# Altium project SynthyTwo.Project.PrjPcb
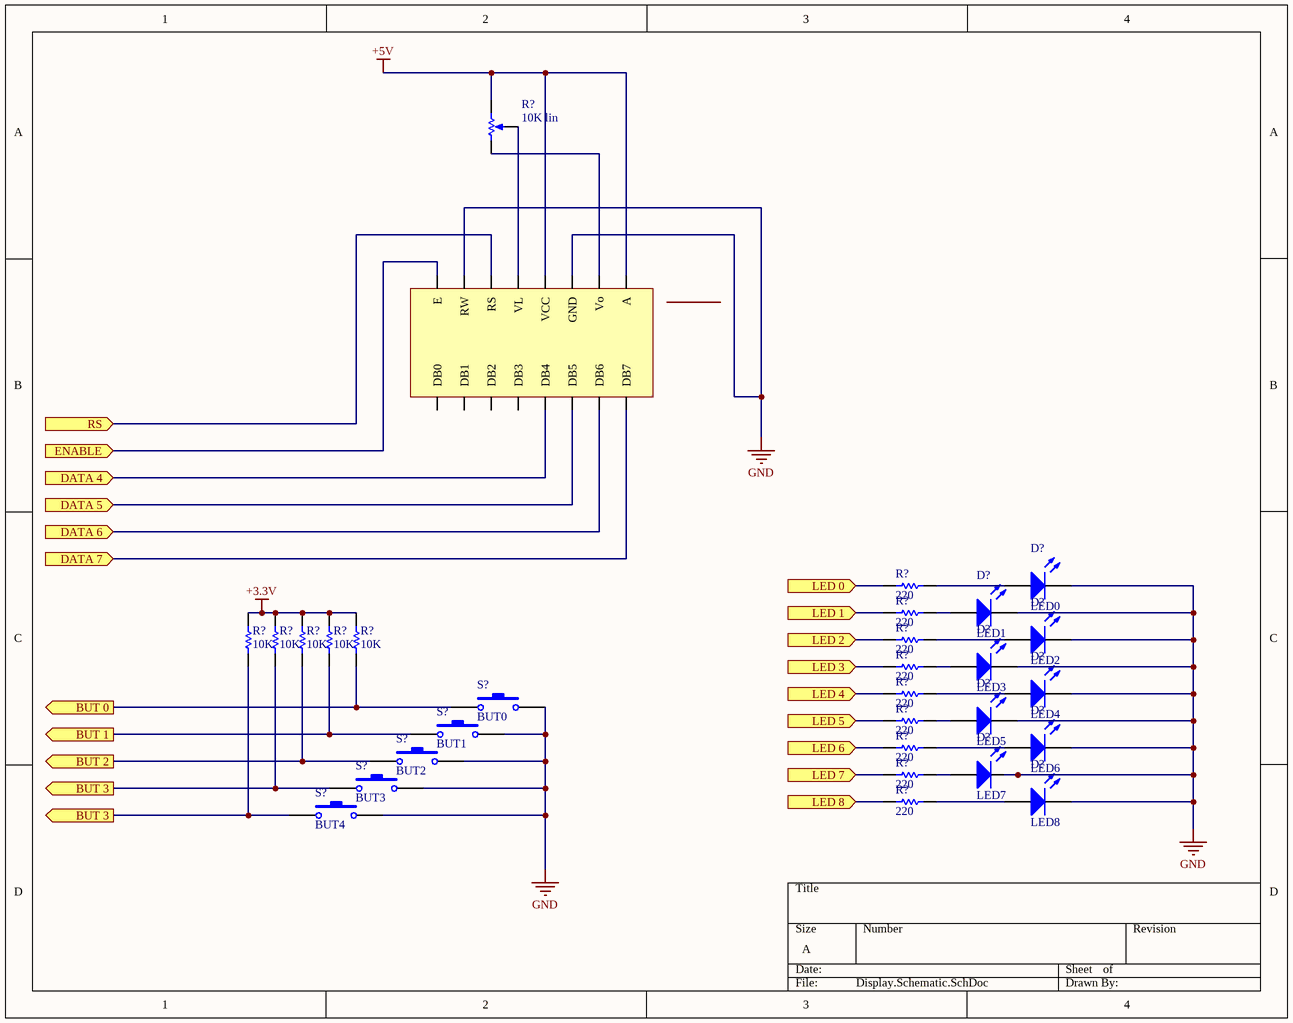
[diagram p0: Display.Schematic.SchDoc]
5 sheets, 172 parts. Net scope: flat (ports and power ports of the same name join across sheets).
Sheets:
  Display.Schematic.SchDoc
  FilterBoard.Schematic.SchDoc
  Output.Schematic.SchDoc
  MIDI.Schematic.SchDoc
  Encodeurs.Schematic.SchDoc

## Sheet Display.Schematic.SchDoc
size A

### Parts
(Parts that share a designator on the sheet are numbered #1, #2 ... from top to bottom, then left to right.)
*  16x2 LCD  (value not drawn)
D?#1  LED0  [LED-0]
D?#2  LED1  [LED-0]
D?#3  LED2  [LED-0]
D?#4  LED3  [LED-0]
D?#5  LED4  [LED-0]
D?#6  LED5  [LED-0]
D?#7  LED6  [LED-0]
D?#8  LED7  [LED-0]
D?#9  LED8  [LED-0]
R?#1  10K lin  [VR5]
R?#2  220  [AXIAL-0.3]
R?#3  220  [AXIAL-0.3]
R?#4  220  [AXIAL-0.3]
R?#5  10K  [AXIAL-0.3]
R?#6  10K  [AXIAL-0.3]
R?#7  10K  [AXIAL-0.3]
R?#8  10K  [AXIAL-0.3]
R?#9  10K  [AXIAL-0.3]
R?#10  220  [AXIAL-0.3]
R?#11  220  [AXIAL-0.3]
R?#12  220  [AXIAL-0.3]
R?#13  220  [AXIAL-0.3]
R?#14  220  [AXIAL-0.3]
R?#15  220  [AXIAL-0.3]
S?#1  BUT0  [SPST-2]
S?#2  BUT1  [SPST-2]
S?#3  BUT2  [SPST-2]
S?#4  BUT3  [SPST-2]
S?#5  BUT4  [SPST-2]

### Ports
BUT 0 (out), BUT 1 (out), BUT 2 (out), BUT 3 (out), DATA 4 (in), DATA 5 (in), DATA 6 (in), DATA 7 (in), ENABLE (in), LED 0 (in), LED 1 (in), LED 2 (in), LED 3 (in), LED 4 (in), LED 5 (in), LED 6 (in), LED 7 (in), LED 8 (in), RS (in)

### Nets
+3.3V: R?#5.2 R?#6.2 R?#7.2 R?#8.2 R?#9.2
+5V: *.2(VCC) *.16(A) R?#1.2(BOT)
GND: *.1(GND) *.5(RW) D?#1.2(K) D?#2.2(K) D?#3.2(K) D?#4.2(K) D?#5.2(K) D?#6.2(K) D?#7.2(K) D?#8.2(K) D?#9.2(K) S?#1.2 S?#2.2 S?#3.2 S?#4.2 S?#5.2
Net*_3: *.3(VL) R?#1.3(TAP)
Net*_4: *.4(RS) ; port RS
Net*_6: *.6(E) ; port ENABLE
Net*_7: *.7(DB7) ; port DATA 7
Net*_8: *.8(DB6) ; port DATA 6
Net*_9: *.9(DB5) ; port DATA 5
Net*_10: *.10(DB4) ; port DATA 4
Net*_15: *.15(Vo) R?#1.1(TOP)
NetD?#1_1: D?#1.1(A) R?#2.2
NetD?#2_1: D?#2.1(A) R?#3.2
NetD?#3_1: D?#3.1(A) R?#4.2
NetD?#4_1: D?#4.1(A) R?#10.2
NetD?#5_1: D?#5.1(A) R?#11.2
NetD?#6_1: D?#6.1(A) R?#12.2
NetD?#7_1: D?#7.1(A) R?#13.2
NetD?#8_1: D?#8.1(A) R?#14.2
NetD?#9_1: D?#9.1(A) R?#15.2
NetR?#2_1: R?#2.1 ; port LED 0
NetR?#3_1: R?#3.1 ; port LED 1
NetR?#4_1: R?#4.1 ; port LED 2
NetR?#5_1: R?#5.1 R?#6.1 S?#4.1 S?#5.1 ; port BUT 3
NetR?#7_1: R?#7.1 S?#3.1 ; port BUT 2
NetR?#8_1: R?#8.1 S?#2.1 ; port BUT 1
NetR?#9_1: R?#9.1 S?#1.1 ; port BUT 0
NetR?#10_1: R?#10.1 ; port LED 3
NetR?#11_1: R?#11.1 ; port LED 4
NetR?#12_1: R?#12.1 ; port LED 5
NetR?#13_1: R?#13.1 ; port LED 6
NetR?#14_1: R?#14.1 ; port LED 7
NetR?#15_1: R?#15.1 ; port LED 8

Not connected (* = marked no-connect by the designer): * 11(DB3) 12(DB2) 13(DB1) 14(DB0)

### Library data of the parts
* = Display
D?#1-D?#9 = LED0: Typical INFRARED GaAs LED; Published: 8-Jun-2000; LatestRevisionDate: 08-Jul-2005; LatestRevisionNote: Mech Layer 1 removed.; PackageReference: LED-0; Publisher: Altium Limited; PackageDescription: LED; 2 Leads
R?#1 = RPot: Potentiometer; Sim Note: Enter the Resistance value and the set point into parameter fields.; Set Position: 0.5; Published: 8-Jun-2000; LatestRevisionDate: 17-Jul-2002; LatestRevisionNote: Re-released for DXP Platform.; PackageReference: VR5; Publisher: Altium Limited; PackageDescription: Variable Resistor, Thru-Hole; 3 Leads; Value: 10K
R?#2 R?#3 R?#5-R?#9 = Res1: Resistor; Value: 1K; Published: 8-Jun-2000; LatestRevisionDate: 17-Jul-2002; LatestRevisionNote: Re-released for DXP Platform.; PackageReference: AXIAL-0.3; Publisher: Altium Limited; PackageDescription: Axial Device, Thru-Hole; 2 Leads; 0.3 in Pin Spacing
R?#4 R?#10-R?#15 = Res1: Resistor; Published: 8-Jun-2000; LatestRevisionDate: 17-Jul-2002; LatestRevisionNote: Re-released for DXP Platform.; PackageReference: AXIAL-0.3; Publisher: Altium Limited; PackageDescription: Axial Device, Thru-Hole; 2 Leads; 0.3 in Pin Spacing; Value: 220
S?#1-S?#5 = SW-PB: Switch; Published: 24-Mar-1999; LatestRevisionDate: 17-Jul-2002; LatestRevisionNote: Re-released for DXP Platform.; PackageReference: SPST-2; Publisher: Altium Limited; PackageDescription: Switch; 2 Leads

## Sheet FilterBoard.Schematic.SchDoc
size B
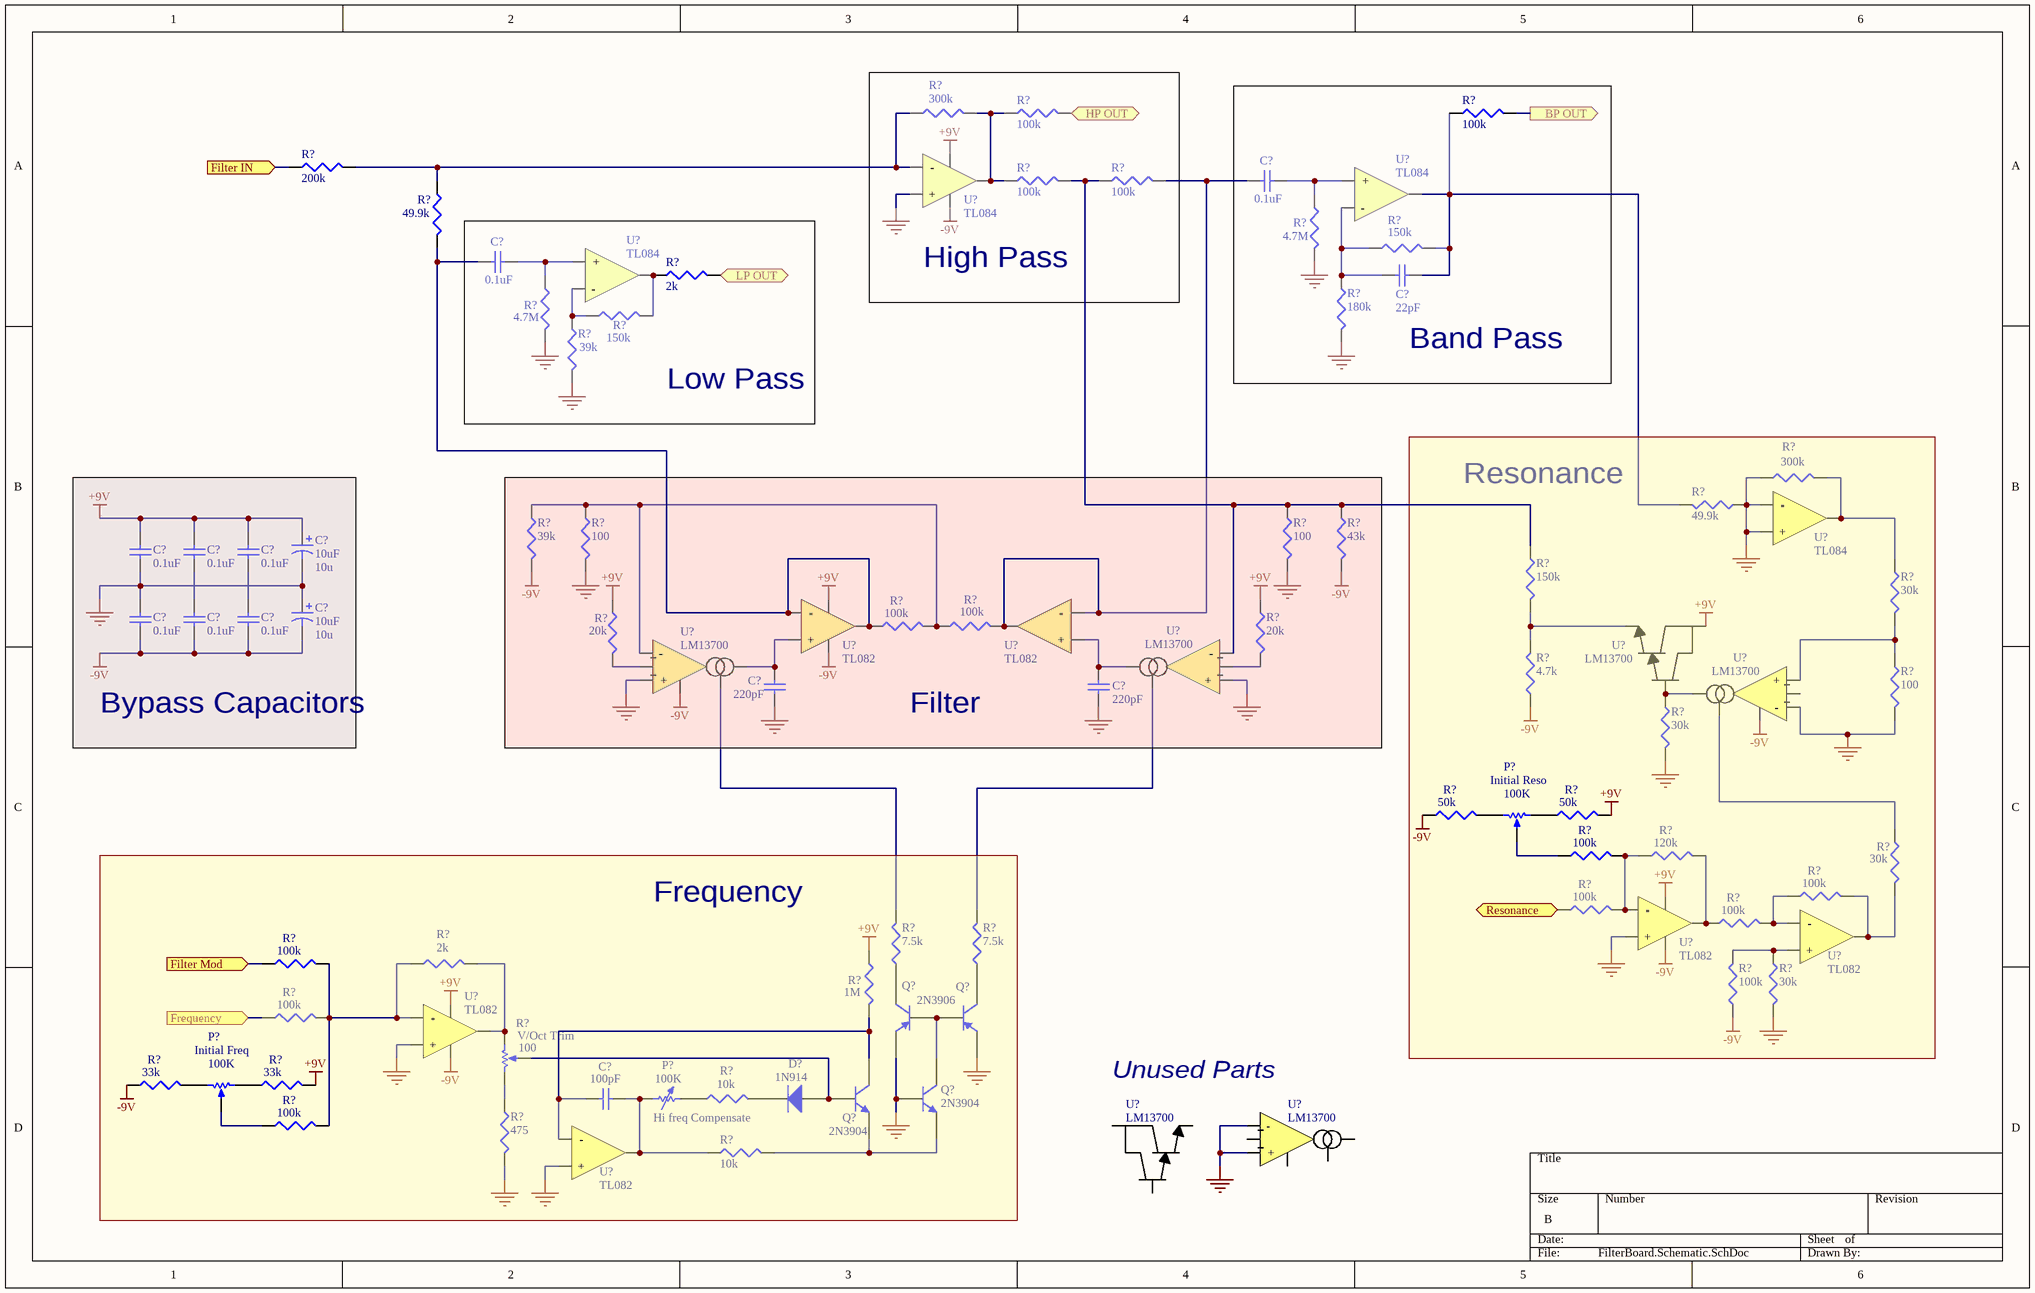
[diagram p1: FilterBoard.Schematic.SchDoc]

### Parts
(Parts that share a designator on the sheet are numbered #1, #2 ... from top to bottom, then left to right.)
C?#1  0.1uF  [C1206]
C?#2  0.1uF  [C1206]
C?#3  22pF  [C1206]
C?#4  10uF  value 10u  [RB7.6-15]
C?#5  0.1uF  [C1206]
C?#6  0.1uF  [C1206]
C?#7  0.1uF  [C1206]
C?#8  10uF  value 10u  [RB7.6-15]
C?#9  0.1uF  [C1206]
C?#10  0.1uF  [C1206]
C?#11  0.1uF  [C1206]
C?#12  220pF  [C1206]
C?#13  220pF  [C1206]
C?#14  100pF  [C1206]
D?#10  1N914  [DO-41]
P?#1  Initial Reso  value 100K  [VR5]
P?#2  Hi freq Compensate  value 100K  [AXIAL-0.7]
P?#3  Initial Freq  value 100K  [VR5]
Q?#1  2N3906  [TO-92A]
Q?#2  2N3906  [TO-92A]  (value not drawn)
Q?#3  2N3904  [TO-92A]
Q?#4  2N3904  [TO-92A]
R?#16  300k  [J1-0603]
R?#17  100k  [J1-0603]
R?#18  100k  [J1-0603]
R?#19  200k  [J1-0603]
R?#20  100k  [J1-0603]
R?#21  100k  [J1-0603]
R?#22  49.9k  [J1-0603]
R?#23  4.7M  [J1-0603]
R?#24  150k  [J1-0603]
R?#25  2k  [J1-0603]
R?#26  4.7M  [J1-0603]
R?#27  180k  [J1-0603]
R?#28  150k  [J1-0603]
R?#29  39k  [J1-0603]
R?#30  300k  [J1-0603]
R?#31  39k  [J1-0603]
R?#32  100  [J1-0603]
R?#33  100  [J1-0603]
R?#34  43k  [J1-0603]
R?#35  49.9k  [J1-0603]
R?#36  150k  [J1-0603]
R?#37  30k  [J1-0603]
R?#38  20k  [J1-0603]
R?#39  100k  [J1-0603]
R?#40  100k  [J1-0603]
R?#41  20k  [J1-0603]
R?#42  100  [J1-0603]
R?#43  4.7k  [J1-0603]
R?#44  30k  [J1-0603]
R?#45  50k  [J1-0603]
R?#46  50k  [J1-0603]
R?#47  100k  [J1-0603]
R?#48  120k  [J1-0603]
R?#49  30k  [J1-0603]
R?#50  100k  [J1-0603]
R?#51  100k  [J1-0603]
R?#52  100k  [J1-0603]
R?#53  100k  [J1-0603]
R?#54  2k  [J1-0603]
R?#55  7.5k  [J1-0603]
R?#56  1M  [J1-0603]
R?#57  7.5k  [J1-0603]
R?#58  30k  [J1-0603]
R?#59  100k  [J1-0603]
R?#60  100k  [J1-0603]
R?#61  V/Oct Trim  value 100  [VR5]
R?#62  33k  [J1-0603]
R?#63  33k  [J1-0603]
R?#64  10k  [J1-0603]
R?#65  100k  [J1-0603]
R?#66  475  [J1-0603]
R?#67  10k  [J1-0603]
U?#1  TL084
U?#2  TL084
U?#3  TL084
U?#4  TL084
U?#5  TL082
U?#6  TL082
U?#7  LM13700
U?#8  LM13700
U?#9  LM13700
U?#10  LM13700
U?#11  TL082
U?#12  TL082
U?#13  TL082
U?#14  LM13700
U?#15  TL082
U?#16  LM13700

### Blocks framed on the sheet
High Pass: R?#16 R?#17 R?#20 R?#21 U?#1
Band Pass: C?#1 C?#3 R?#18 R?#23 R?#24 R?#27 U?#2
Low Pass: C?#2 R?#25 R?#26 R?#28 R?#29 U?#3
Resonance: P?#1 R?#30 R?#35-R?#37 R?#42-R?#52 R?#58 R?#60 U?#4 U?#9-U?#12
Bypass Capacitors: C?#4-C?#11
Filter: C?#12 C?#13 R?#31-R?#34 R?#38-R?#41 U?#5-U?#8
Frequency: C?#14 D?#10 P?#2 P?#3 Q?#1-Q?#4 R?#53-R?#57 R?#59 R?#61-R?#67 U?#13 U?#15

### Ports
BP OUT (out), Filter IN (in), Filter Mod (in), Frequency (in), HP OUT (out), LP OUT (out), Resonance (in)

### Nets
+9V: C?#4.1 C?#5.2 C?#6.2 C?#7.2 R?#38.1 R?#41.1 R?#46.2 R?#56.1 R?#63.2 U?#1.4(VCC+) U?#5.8(VCC+) U?#9.11(V+) U?#11.8(VCC+) U?#13.8(VCC+)
-9V: C?#8.2 C?#9.1 C?#10.1 C?#11.1 R?#31.2 R?#34.2 R?#43.1 R?#45.1 R?#60.1 R?#62.1 U?#1.11(VCC-) U?#5.4(VCC-) U?#7.6(VCC-) U?#10.6(VCC-) U?#11.4(VCC-) U?#13.4(VCC-)
GND: C?#4.2 C?#5.1 C?#8.1 C?#9.2 C?#12.1 C?#13.1 Q?#1.1(E) Q?#2.1(E) Q?#4.2(B) R?#23.2 R?#26.2 R?#27.2 R?#29.2 R?#30.1 R?#32.2 R?#33.2 R?#35.1 R?#42.2 R?#44.2 R?#58.2 R?#66.2 U?#1.3(+) U?#4.12(-) U?#4.13(+) U?#7.3(+) U?#8.3(+) U?#10.3(-) U?#11.3(+) U?#13.3(+) U?#14.3(+) U?#14.4(-) U?#15.5(+)
NetC?#1_1: C?#1.1 R?#21.2 R?#40.2 U?#6.6(-) U?#6.7(OUT)
NetC?#1_2: C?#1.2 R?#23.1 U?#2.5(+)
NetC?#2_1: C?#2.1 R?#22.2 R?#39.1 U?#5.1(OUT) U?#5.2(-)
NetC?#2_2: C?#2.2 R?#26.1 U?#3.5(+)
NetC?#3_1: C?#3.1 R?#24.1 R?#27.1 U?#2.3(-)
NetC?#3_2: C?#3.2 R?#18.1 R?#24.2 R?#35.2 U?#2.7(OUT)
NetC?#6_1: C?#6.1 C?#10.2
NetC?#7_1: C?#7.1 C?#11.2
NetC?#12_2: C?#12.2 U?#5.3(+) U?#7.5(OUT)
NetC?#13_2: C?#13.2 U?#6.5(+) U?#8.5(OUT)
NetC?#14_1: C?#14.1 Q?#3.3(C) R?#56.2 U?#15.6(-)
NetC?#14_2: C?#14.2 P?#2.1 R?#67.1 U?#15.7(OUT)
NetD?#10_1: D?#10.1(A) Q?#3.2(B) R?#61.3(TAP)
NetD?#10_2: D?#10.2(K) R?#64.2
NetP?#1_1: P?#1.1(TOP) R?#46.1
NetP?#1_2: P?#1.2(BOT) R?#45.2
NetP?#1_3: P?#1.3(TAP) R?#47.1
NetP?#2_2: P?#2.2 R?#64.1
NetP?#3_1: P?#3.1(TOP) R?#63.1
NetP?#3_2: P?#3.2(BOT) R?#62.2
NetP?#3_3: P?#3.3(TAP) R?#65.1
NetQ?#1_2: Q?#1.2(B) Q?#2.2(B) Q?#4.3(C)
NetQ?#1_3: Q?#1.3(C) R?#55.1
NetQ?#2_3: Q?#2.3(C) R?#57.1
NetQ?#3_1: Q?#3.1(E) Q?#4.1(E) R?#67.2
NetR?#16_1: R?#16.1 R?#19.2 R?#22.1 U?#1.2(-)
NetR?#16_2: R?#16.2 R?#17.1 R?#20.1 U?#1.1(OUT)
NetR?#17_2: R?#17.2 ; port HP OUT
NetR?#18_2: R?#18.2 ; port BP OUT
NetR?#19_1: R?#19.1 ; port Filter IN
NetR?#20_2: R?#20.2 R?#21.1 R?#33.1 R?#34.1 R?#36.1 U?#8.4(-)
NetR?#25_1: R?#25.1 R?#28.2 U?#3.7(OUT)
NetR?#25_2: R?#25.2 ; port LP OUT
NetR?#28_1: R?#28.1 R?#29.1 U?#3.3(-)
NetR?#30_2: R?#30.2 R?#37.1 U?#4.14(OUT)
NetR?#31_1: R?#31.1 R?#32.1 R?#39.2 R?#40.1 U?#7.4(-)
NetR?#36_2: R?#36.2 R?#43.2 U?#9.8(BOUT)
NetR?#37_2: R?#37.2 R?#42.1 U?#10.4(+)
NetR?#38_2: R?#38.2 U?#7.2
NetR?#41_2: R?#41.2 U?#8.2
NetR?#44_1: R?#44.1 U?#9.7(BIN) U?#10.5(OUT)
NetR?#47_2: R?#47.2 R?#48.1 R?#51.2 U?#11.2(-)
NetR?#48_2: R?#48.2 R?#52.1 U?#11.1(OUT)
NetR?#49_1: R?#49.1 U?#10.1(BIAS)
NetR?#49_2: R?#49.2 R?#50.2 U?#12.7(OUT)
NetR?#50_1: R?#50.1 R?#52.2 U?#12.6(-)
NetR?#51_1: R?#51.1 ; port Resonance
NetR?#53_1: R?#53.1 ; port Filter Mod
NetR?#53_2: R?#53.2 R?#54.1 R?#59.2 R?#65.2 U?#13.2(-)
NetR?#54_2: R?#54.2 R?#61.1(TOP) U?#13.1(OUT)
NetR?#55_2: R?#55.2 U?#7.1(BIAS)
NetR?#57_2: R?#57.2 U?#8.1(BIAS)
NetR?#58_1: R?#58.1 R?#60.2 U?#12.5(+)
NetR?#59_1: R?#59.1 ; port Frequency
NetR?#61_2: R?#61.2(BOT) R?#66.1

Not connected (* = marked no-connect by the designer): U?#2 6(VCC+) 11(VCC-); U?#3 6(VCC+) 11(VCC-); U?#4 1(VCC+) 11(VCC-); U?#6 4(VCC-) 8(VCC+); U?#8 6(VCC-); U?#10 2; U?#12 4(VCC-) 8(VCC+); U?#14 1(BIAS) 2 5(OUT) 6(VCC-); U?#15 4(VCC-) 8(VCC+); U?#16 7(BIN) 8(BOUT) 11(V+)

### Notes on the sheet
- (near U?#16) Unused Parts

### Library data of the parts
C?#1 C?#2 C?#5-C?#7 C?#9-C?#11 = Cap Semi: Capacitor (Semiconductor SIM Model); Value: 0.1u; Published: 8-Jun-2000; LatestRevisionDate: 29-May-2009; LatestRevisionNote: IPC-7351 Footprint Added.; PackageReference: C1206; Publisher: Altium Limited; PackageDescription: Chip Capacitor
C?#3 = Cap Semi: Capacitor (Semiconductor SIM Model); Value: 22p; Published: 8-Jun-2000; LatestRevisionDate: 29-May-2009; LatestRevisionNote: IPC-7351 Footprint Added.; PackageReference: C1206; Publisher: Altium Limited; PackageDescription: Chip Capacitor
C?#4 C?#8 = Cap Pol1: Polarized Capacitor (Radial); Published: 8-Jun-2000; LatestRevisionDate: 17-Jul-2002; LatestRevisionNote: Re-released for DXP Platform.; PackageReference: RB7.6-15; Publisher: Altium Limited; PackageDescription: Polarized Capacitor (Radial); 2 Leads
C?#12 C?#13 = Cap Semi: Capacitor (Semiconductor SIM Model); Value: 220p; Published: 8-Jun-2000; LatestRevisionDate: 29-May-2009; LatestRevisionNote: IPC-7351 Footprint Added.; PackageReference: C1206; Publisher: Altium Limited; PackageDescription: Chip Capacitor
C?#14 = Cap Semi: Capacitor (Semiconductor SIM Model); Value: 100p; Published: 8-Jun-2000; LatestRevisionDate: 29-May-2009; LatestRevisionNote: IPC-7351 Footprint Added.; PackageReference: C1206; Publisher: Altium Limited; PackageDescription: Chip Capacitor
D?#10 = Diode 1N4001: 1 Amp General Purpose Rectifier; Published: 8-Jun-2000; LatestRevisionDate: 17-Jul-2002; LatestRevisionNote: Re-released for DXP Platform.; DatasheetVersion: 1998; PackageVersion: Aug-1999; PackageReference: DO-41; Publisher: Altium Limited; PackageDescription: Diode, Axial; Body 5.2 x 2.7 mm (LxDia. max), Lead Dia. 0.86 mm (max); Code_JEDEC: DO-204-AL; ComponentLink1Description: Manufacturer Link; ComponentLink1URL: http://www.fairchildsemi.com/; ComponentLink2Description: Datasheet; ComponentLink2URL: http://www.fairchildsemi.com/ds/1N%2F1N4001.pdf
P?#1 P?#3 R?#61 = RPot: as R?#1 on sheet Display.Schematic; Published: 8-Jun-2000; LatestRevisionDate: 17-Jul-2002; LatestRevisionNote: Re-released for DXP Platform.; PackageReference: VR5; Publisher: Altium Limited; PackageDescription: Variable Resistor, Thru-Hole; 3 Leads
P?#2 = Res Adj1: Variable Resistor; Set Position: 0.5; Published: 8-Jun-2000; LatestRevisionDate: 17-Jul-2002; LatestRevisionNote: Re-released for DXP Platform.; PackageReference: AXIAL-0.7; Publisher: Altium Limited; PackageDescription: Axial Device, Thru-Hole; 2 Leads; 0.7 in Pin Spacing
Q?#1 Q?#2 = 2N3906: PNP General Purpose Amplifier; Published: 8-Jun-2000; LatestRevisionDate: 15-Jan-2003; LatestRevisionNote: PCB Footprint 'BCY-W3/D4.7' replaced; DatasheetVersion: 1997; PackageVersion: Sep-1998; PackageReference: TO-92A; Publisher: Altium Limited; PackageDescription: TO, Flat Index; 3 In-Line, Axial Leads; Body Dia. 4.5mm; Leads 0.51 x 0.48 mm (max); ComponentLink1Description: Manufacturer Link; ComponentLink1URL: http://www.fairchildsemi.com/; ComponentLink2Description: Datasheet; ComponentLink2URL: http://www.fairchildsemi.com/ds/2N%2F2N3906.pdf
Q?#3 Q?#4 = 2N3904: NPN General Purpose Amplifier; Published: 8-Jun-2000; LatestRevisionDate: 15-Jan-2003; LatestRevisionNote: PCB Footprint 'BCY-W3/D4.7' replaced; DatasheetVersion: 1997; PackageVersion: Sep-1998; PackageReference: TO-92A; Publisher: Altium Limited; PackageDescription: TO, Flat Index; 3 In-Line, Axial Leads; Body Dia. 4.5mm; Leads 0.51 x 0.48 mm (max); ComponentLink1Description: Manufacturer Link; ComponentLink1URL: http://www.fairchildsemi.com/; ComponentLink2Description: Datasheet; ComponentLink2URL: http://www.fairchildsemi.com/ds/2N%2F2N3904.pdf
R?#16-R?#24 R?#26-R?#60 R?#62-R?#67 = Res3: Resistor; Published: 8-Jun-2000; LatestRevisionDate: 29-May-2009; LatestRevisionNote: IPC-7351 Footprint Added.; PackageReference: J1-0603; Publisher: Altium Limited; PackageDescription: Chip Resistor
  R?#16 R?#30: Value: 300K
  R?#17 R?#18 R?#20 R?#21 R?#39 R?#40 R?#47 R?#50-R?#53 R?#59 R?#60 R?#65: Value: 100K
  R?#19: Value: 200K
  R?#22 R?#35: Value: 49.9K
  R?#23 R?#26: Value: 4.7M
  R?#24 R?#28 R?#36: Value: 150K
  R?#27: Value: 180K
  R?#29 R?#31: Value: 39K
  R?#32 R?#33 R?#42: Value: 100
  R?#34: Value: 43K
  R?#37 R?#44 R?#49 R?#58: Value: 30K
  R?#38 R?#41: Value: 20K
  R?#43: Value: 4.7K
  R?#45 R?#46: Value: 50K
  R?#48: Value: 120K
  R?#54: Value: 2K
  R?#55 R?#57: Value: 7.5K
  R?#56: Value: 1M
  R?#62 R?#63: Value: 33K
  R?#64 R?#67: Value: 10K
  R?#66: Value: 475
R?#25 = Res3: Resistor; Value: 100K; Published: 8-Jun-2000; LatestRevisionDate: 29-May-2009; LatestRevisionNote: IPC-7351 Footprint Added.; PackageReference: J1-0603; Publisher: Altium Limited; PackageDescription: Chip Resistor
U?#9 U?#16 = LM13700_1

## Sheet Output.Schematic.SchDoc
size A
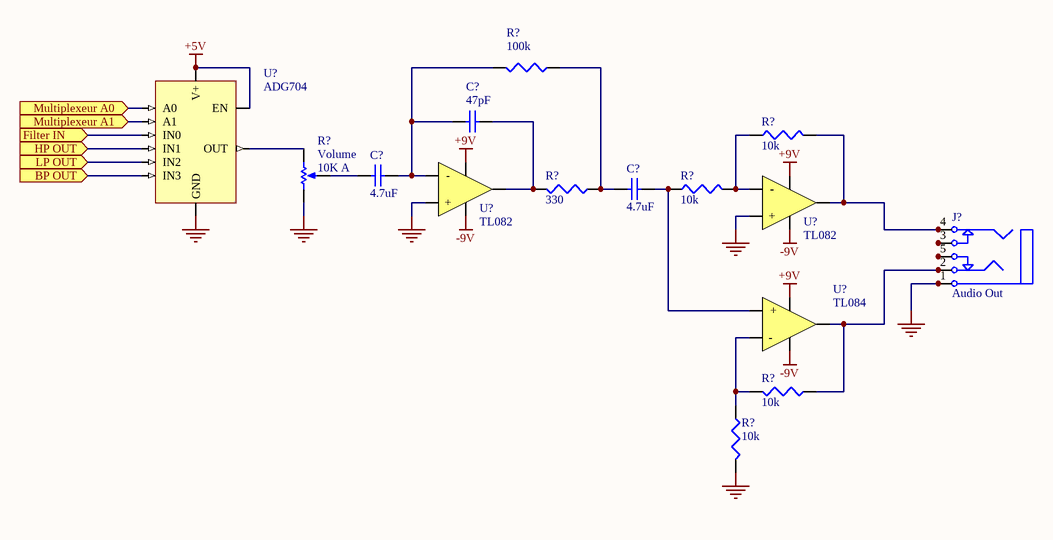
[diagram p2: Output.Schematic.SchDoc]

### Parts
(Parts that share a designator on the sheet are numbered #1, #2 ... from top to bottom, then left to right.)
C?#15  47pF  [C1206]
C?#16  4.7uF  [C1206]
C?#17  4.7uF  [C1206]
J?  Audio Out  [ST-3150-5N]
R?#68  100k  [J1-0603]
R?#69  10k  [J1-0603]
R?#70  10k  [J1-0603]
R?#71  Volume  value 10K A  [VR5]
R?#72  330  [J1-0603]
R?#73  10k  [J1-0603]
R?#74  10k  [J1-0603]
U?#17  ADG704
U?#18  TL082
U?#19  TL082
U?#20  TL084

### Ports
BP OUT (in), Filter IN (in), HP OUT (in), LP OUT (in), Multiplexeur A0 (in), Multiplexeur A1 (in)

### Nets
+5V: U?#17.5(EN) U?#17.6(V+)
+9V: U?#18.8(VCC+) U?#19.8(VCC+) U?#20.4(VCC+)
-9V: U?#18.4(VCC-) U?#19.4(VCC-) U?#20.11(VCC-)
GND: J?.1 J?.1A J?.1B R?#71.1(TOP) R?#74.2 U?#17.3(GND) U?#18.3(+) U?#19.3(+)
NetC?#15_1: C?#15.1 C?#16.2 R?#68.2 U?#18.2(-)
NetC?#15_2: C?#15.2 R?#72.2 U?#18.1(OUT)
NetC?#16_1: C?#16.1 R?#71.3(TAP)
NetC?#17_1: C?#17.1 R?#68.1 R?#72.1
NetC?#17_2: C?#17.2 R?#70.1 U?#20.2(+)
NetJ?_2: J?.2 J?.2A J?.2B R?#73.1 U?#20.1(OUT)
NetJ?_3: J?.3 J?.3A J?.3B
NetJ?_4: J?.4 J?.4A J?.4B R?#69.2 U?#19.1(OUT)
NetJ?_5: J?.5 J?.5A J?.5B
NetR?#17_2: U?#17.9(IN1) ; port HP OUT
NetR?#18_2: U?#17.7(IN3) ; port BP OUT
NetR?#19_1: U?#17.2(IN0) ; port Filter IN
NetR?#25_2: U?#17.4(IN2) ; port LP OUT
NetR?#69_1: R?#69.1 R?#70.2 U?#19.2(-)
NetR?#71_2: R?#71.2(BOT) U?#17.8(OUT)
NetR?#73_2: R?#73.2 R?#74.1 U?#20.3(-)
NetU?#17_1: U?#17.1(A0) ; port Multiplexeur A0
NetU?#17_10: U?#17.10(A1) ; port Multiplexeur A1

### Library data of the parts
C?#15 = Cap Semi: Capacitor (Semiconductor SIM Model); Published: 8-Jun-2000; LatestRevisionDate: 29-May-2009; LatestRevisionNote: IPC-7351 Footprint Added.; PackageReference: C1206; Publisher: Altium Limited; PackageDescription: Chip Capacitor; Value: 47pF
C?#16 C?#17 = Cap Semi: Capacitor (Semiconductor SIM Model); Value: 4.7u; Published: 8-Jun-2000; LatestRevisionDate: 29-May-2009; LatestRevisionNote: IPC-7351 Footprint Added.; PackageReference: C1206; Publisher: Altium Limited; PackageDescription: Chip Capacitor
J? = Phonejack Stereo SW: 3-Conductor Jack with 2 break contacts (normals) and 2 auxiliary make contacts; Published: 5-Jan-2004; LatestRevisionDate: 17-Dec-2003; LatestRevisionNote: PCB Footprint replaced.; DatasheetDocument: 07-Mar-2000; Publisher: Altium Limited; ComponentLink1Description: Manufacturer Link; ComponentLink1URL: http://domino.kycon.com/internet/Products.html
R?#68-R?#70 R?#72-R?#74 = Res3: Resistor; Published: 8-Jun-2000; LatestRevisionDate: 29-May-2009; LatestRevisionNote: IPC-7351 Footprint Added.; PackageReference: J1-0603; Publisher: Altium Limited; PackageDescription: Chip Resistor
  R?#68: Value: 100K
  R?#69 R?#70 R?#73 R?#74: Value: 10K
  R?#72: Value: 330
R?#71 = RPot: as R?#1 on sheet Display.Schematic; Published: 8-Jun-2000; LatestRevisionDate: 17-Jul-2002; LatestRevisionNote: Re-released for DXP Platform.; PackageReference: VR5; Publisher: Altium Limited; PackageDescription: Variable Resistor, Thru-Hole; 3 Leads

## Sheet MIDI.Schematic.SchDoc
size A
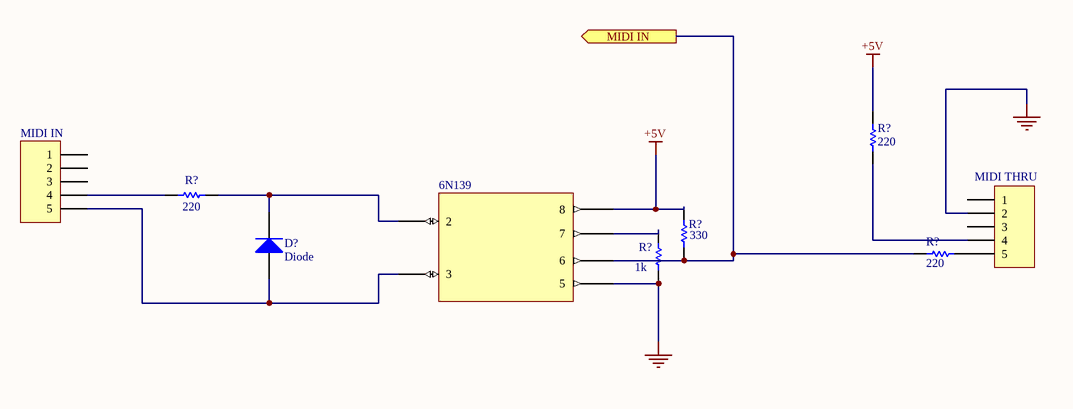
[diagram p3: MIDI.Schematic.SchDoc]

### Parts
(Parts that share a designator on the sheet are numbered #1, #2 ... from top to bottom, then left to right.)
6N139  6N139  (value not drawn)
D?#11  Diode  [SMC]
MIDI_IN  Header 5  [HDR1X5]  (value not drawn)
MIDI_THRU  Header 5  [HDR1X5]  (value not drawn)
R?#75  value 220  [AXIAL-0.3]  (hidden comment: Res1)
R?#76  value 220  [AXIAL-0.3]  (hidden comment: Res1)
R?#77  330  [AXIAL-0.3]
R?#78  value 220  [AXIAL-0.3]  (hidden comment: Res1)
R?#79  1k  [AXIAL-0.3]

### Ports
MIDI IN (out)

### Nets
+5V: 6N139.?3(8) R?#75.2 R?#77.2
GND: 6N139.?4(5) MIDI_THRU.2 R?#79.1
Net6N139_?1: 6N139.?1(3) D?#11.1(A) MIDI_IN.5
Net6N139_?2: 6N139.?2(2) D?#11.2(K) R?#76.2
Net6N139_?5: 6N139.?5(7) R?#79.2
Net6N139_?6: 6N139.?6(6) R?#77.1 R?#78.2 ; port MIDI IN
NetMIDI_IN_4: MIDI_IN.4 R?#76.1
NetMIDI_THRU_4: MIDI_THRU.4 R?#75.1
NetMIDI_THRU_5: MIDI_THRU.5 R?#78.1

Not connected (* = marked no-connect by the designer): MIDI_IN 1 2 3; MIDI_THRU 1 3

### Library data of the parts
D?#11 = Diode: Default Diode; Published: 8-Jun-2000; LatestRevisionDate: 17-Jul-2002; LatestRevisionNote: Re-released for DXP Platform.; PackageVersion: Sep-1996; PackageReference: SMC; Publisher: Altium Limited; PackageDescription: DO-214-AB/SMC; 2 C-Bend Leads; Body 7.9 x 5.9 mm, inc. leads (LxW); Code_JEDEC: DO-214-AB
MIDI_IN MIDI_THRU = Header 5: DIN 5 Pins; LatestRevisionDate: 17-Jul-2002; LatestRevisionNote: Re-released for DXP Platform.; Publisher: Altium Limited
R?#75-R?#79 = Res1: Resistor; Published: 8-Jun-2000; LatestRevisionDate: 17-Jul-2002; LatestRevisionNote: Re-released for DXP Platform.; PackageReference: AXIAL-0.3; Publisher: Altium Limited; PackageDescription: Axial Device, Thru-Hole; 2 Leads; 0.3 in Pin Spacing
  R?#77: Value: 330
  R?#79: Value: 1K

## Sheet Encodeurs.Schematic.SchDoc
size A
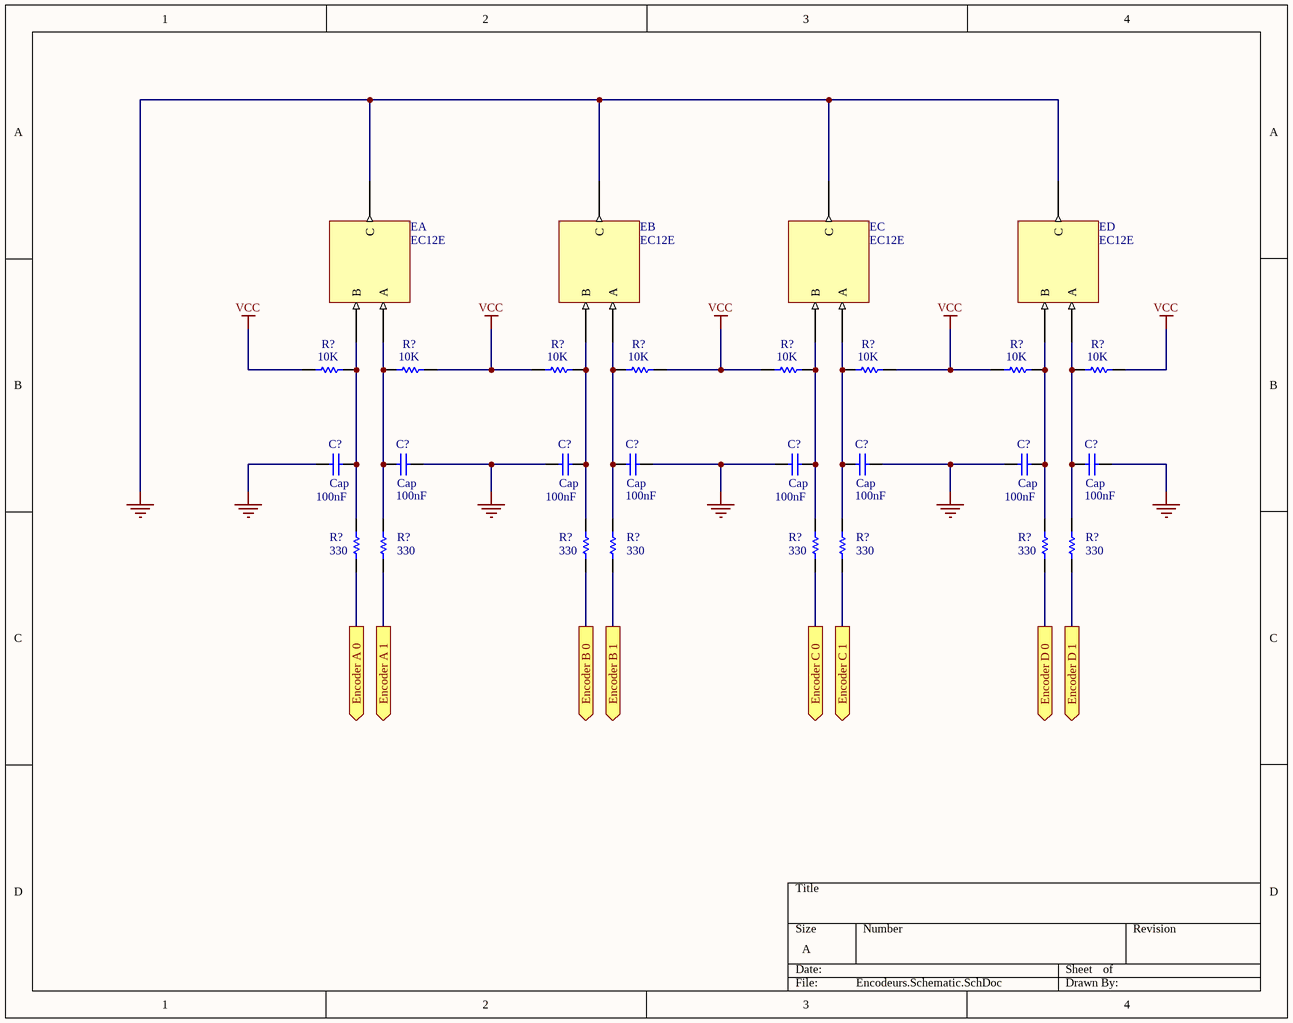
[diagram p4: Encodeurs.Schematic.SchDoc]

### Parts
(Parts that share a designator on the sheet are numbered #1, #2 ... from top to bottom, then left to right.)
C?#18  Cap  value 100nF  [RAD-0.3]
C?#19  Cap  value 100nF  [RAD-0.3]
C?#20  Cap  value 100nF  [RAD-0.3]
C?#21  Cap  value 100nF  [RAD-0.3]
C?#22  Cap  value 100nF  [RAD-0.3]
C?#23  Cap  value 100nF  [RAD-0.3]
C?#24  Cap  value 100nF  [RAD-0.3]
C?#25  Cap  value 100nF  [RAD-0.3]
EA  EC12E
EB  EC12E
EC  EC12E
ED  EC12E
R?#80  10K  [AXIAL-0.3]
R?#81  10K  [AXIAL-0.3]
R?#82  10K  [AXIAL-0.3]
R?#83  10K  [AXIAL-0.3]
R?#84  10K  [AXIAL-0.3]
R?#85  10K  [AXIAL-0.3]
R?#86  10K  [AXIAL-0.3]
R?#87  10K  [AXIAL-0.3]
R?#88  330  [AXIAL-0.3]
R?#89  330  [AXIAL-0.3]
R?#90  330  [AXIAL-0.3]
R?#91  330  [AXIAL-0.3]
R?#92  330  [AXIAL-0.3]
R?#93  330  [AXIAL-0.3]
R?#94  330  [AXIAL-0.3]
R?#95  330  [AXIAL-0.3]

### Ports
Encoder A 0 (out), Encoder A 1 (out), Encoder B 0 (out), Encoder B 1 (out), Encoder C 0 (out), Encoder C 1 (out), Encoder D 0 (out), Encoder D 1 (out)

### Nets
GND: C?#18.1 C?#19.1 C?#20.1 C?#21.1 C?#22.1 C?#23.1 C?#24.1 C?#25.1 EA.GND(C) EB.GND(C) EC.GND(C) ED.GND(C)
VCC: R?#80.1 R?#81.2 R?#82.1 R?#83.2 R?#84.1 R?#85.2 R?#86.1 R?#87.2
NetC?#18_2: C?#18.2 EA.Pin_B(B) R?#80.2 R?#88.2
NetC?#19_2: C?#19.2 EB.Pin_B(B) R?#82.2 R?#90.2
NetC?#20_2: C?#20.2 EC.Pin_B(B) R?#84.2 R?#92.2
NetC?#21_2: C?#21.2 ED.Pin_B(B) R?#86.2 R?#94.2
NetC?#22_2: C?#22.2 EA.Pin_A(A) R?#81.1 R?#89.2
NetC?#23_2: C?#23.2 EB.Pin_A(A) R?#83.1 R?#91.2
NetC?#24_2: C?#24.2 EC.Pin_A(A) R?#85.1 R?#93.2
NetC?#25_2: C?#25.2 ED.Pin_A(A) R?#87.1 R?#95.2
NetR?#88_1: R?#88.1 ; port Encoder A 0
NetR?#89_1: R?#89.1 ; port Encoder A 1
NetR?#90_1: R?#90.1 ; port Encoder B 0
NetR?#91_1: R?#91.1 ; port Encoder B 1
NetR?#92_1: R?#92.1 ; port Encoder C 0
NetR?#93_1: R?#93.1 ; port Encoder C 1
NetR?#94_1: R?#94.1 ; port Encoder D 0
NetR?#95_1: R?#95.1 ; port Encoder D 1

### Library data of the parts
C?#18-C?#25 = Cap: Capacitor; Published: 8-Jun-2000; LatestRevisionDate: 17-Jul-2002; LatestRevisionNote: Re-released for DXP Platform.; PackageReference: RAD-0.3; Publisher: Altium Limited; PackageDescription: Radial Cap, Thru-Hole; 2 Leads; 0.3 in Pin Spacing
R?#80-R?#87 = Res1: Resistor; Published: 8-Jun-2000; LatestRevisionDate: 17-Jul-2002; LatestRevisionNote: Re-released for DXP Platform.; PackageReference: AXIAL-0.3; Publisher: Altium Limited; PackageDescription: Axial Device, Thru-Hole; 2 Leads; 0.3 in Pin Spacing; Value: 10K
R?#88-R?#95 = Res1: Resistor; Value: 330R; Published: 8-Jun-2000; LatestRevisionDate: 17-Jul-2002; LatestRevisionNote: Re-released for DXP Platform.; PackageReference: AXIAL-0.3; Publisher: Altium Limited; PackageDescription: Axial Device, Thru-Hole; 2 Leads; 0.3 in Pin Spacing

## Nets that join several sheets
+5V: Display.Schematic (*.2 *.16 R?#1.2), Output.Schematic (U?#17.5 U?#17.6), MIDI.Schematic (6N139.?3 R?#75.2 R?#77.2)
+9V: FilterBoard.Schematic (14 pins), Output.Schematic (U?#18.8 U?#19.8 U?#20.4)
-9V: FilterBoard.Schematic (16 pins), Output.Schematic (U?#18.4 U?#19.4 U?#20.11)
GND: Display.Schematic (16 pins), FilterBoard.Schematic (32 pins), Output.Schematic (8 pins), MIDI.Schematic (6N139.?4 MIDI_THRU.2 R?#79.1), Encodeurs.Schematic (12 pins)
NetR?#17_2: FilterBoard.Schematic (R?#17.2), Output.Schematic (U?#17.9)
NetR?#18_2: FilterBoard.Schematic (R?#18.2), Output.Schematic (U?#17.7)
NetR?#19_1: FilterBoard.Schematic (R?#19.1), Output.Schematic (U?#17.2)
NetR?#25_2: FilterBoard.Schematic (R?#25.2), Output.Schematic (U?#17.4)